# Altium schematic sheet neigeMegaShield.SchDoc
size A4
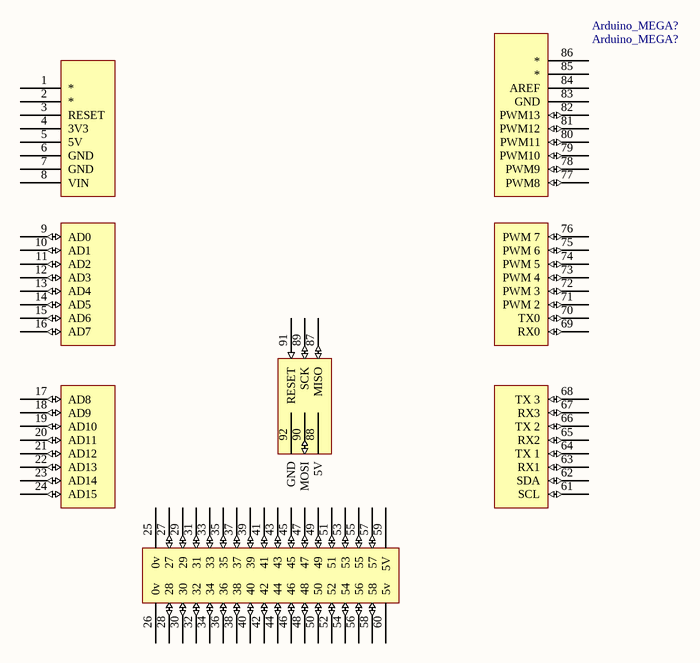
[diagram p0: neigeMegaShield.SchDoc]

## Parts
Arduino_MEGA?  Arduino_MEGA?  [ArduinoMEGA_ALL]

## Nets

Not connected (* = marked no-connect by the designer): Arduino_MEGA? 1(*) 2(*) 3(RESET) 4(3V3) 5(5V) 6(GND) 7(GND) 8(VIN) 9(AD0) 10(AD1) 11(AD2) 12(AD3) 13(AD4) 14(AD5) 15(AD6) 16(AD7) 17(AD8) 18(AD9) 19(AD10) 20(AD11) 21(AD12) 22(AD13) 23(AD14) 24(AD15) 25(0v) 26(0v) 27 28 29 30 31 32 33 34 35 36 37 38 39 40 41 42 43 44 45 46 47 48 49 50 51 52 53 54 55 56 57 58 59(5V) 60(5v) 61(SCL) 62(SDA) 63(RX1) 64(TX_1) 65(RX2) 66(TX_2) 67(RX3) 68(TX_3) 69(RX0) 70(TX0) 71(PWM_2) 72(PWM_3) 73(PWM_4) 74(PWM_5) 75(PWM_6) 76(PWM_7) 77(PWM8) 78(PWM9) 79(PWM10) 80(PWM11) 81(PWM12) 82(PWM13) 83(GND) 84(AREF) 85(*) 86(*) 87(MISO) 88(5V) 89(SCK) 90(MOSI) 91(RESET) 92(GND)

## Library data of the parts
Arduino_MEGA? = Arduino_MEGA